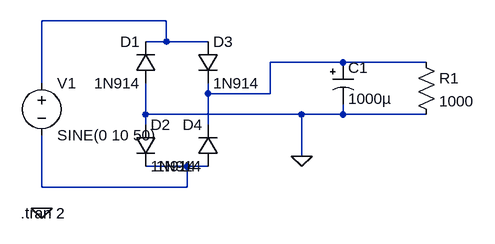
[diagram p0: schematic FullwaveBridgeRectifier.asc]
FullwaveBridgeRectifier.asc, the LTspice schematic file:
Version 4
SHEET 1 880 680
WIRE 176 32 -16 32
WIRE 176 64 176 32
WIRE 176 64 144 64
WIRE 240 64 176 64
WIRE 448 96 336 96
WIRE 576 96 448 96
WIRE -16 128 -16 32
WIRE 240 144 240 128
WIRE 336 144 336 96
WIRE 336 144 240 144
WIRE 144 176 144 128
WIRE 384 176 144 176
WIRE 448 176 448 160
WIRE 448 176 384 176
WIRE 576 176 448 176
WIRE 144 192 144 176
WIRE 240 192 240 144
WIRE 384 240 384 176
WIRE 208 256 144 256
WIRE 240 256 208 256
WIRE -16 288 -16 208
WIRE 208 288 208 256
WIRE 208 288 -16 288
FLAG -16 320 0
FLAG 384 240 0
SYMBOL diode 160 128 R180
WINDOW 0 24 64 Left 2
WINDOW 3 24 0 Left 2
SYMATTR InstName D1
SYMATTR Value 1N914
SYMBOL diode 128 192 R0
SYMATTR InstName D2
SYMATTR Value 1N914
SYMBOL diode 224 64 R0
SYMATTR InstName D3
SYMATTR Value 1N914
SYMBOL diode 256 256 R180
WINDOW 0 24 64 Left 2
WINDOW 3 24 0 Left 2
SYMATTR InstName D4
SYMATTR Value 1N914
SYMBOL voltage -16 112 R0
WINDOW 123 0 0 Left 0
WINDOW 39 0 0 Left 0
SYMATTR InstName V1
SYMATTR Value SINE(0 10 50)
SYMBOL res 560 80 R0
SYMATTR InstName R1
SYMATTR Value 1000
SYMBOL polcap 432 96 R0
WINDOW 3 24 56 Left 2
SYMATTR Value 1000µ
SYMATTR InstName C1
SYMATTR Description Capacitor
SYMATTR Type cap
SYMATTR SpiceLine V=10 Irms=1.06 Rser=0.06 Lser=0 mfg="Nichicon" pn="UPL1A102MPH" type="Al electrolytic"
TEXT -48 328 Left 2 !.tran 2

The netlist it stands for:
* FullwaveBridgeRectifier.asc
D1 0 N001 1N914
D2 0 N003 1N914
D3 N001 N002 1N914
D4 N003 N002 1N914
V1 N001 N003 SINE(0 10 50)
R1 N002 0 1000
C1 N002 0 1000µ V=10 Irms=1.06 Rser=0.06 Lser=0 mfg="Nichicon" pn="UPL1A102MPH" type="Al electrolytic"
.model D D
.lib standard.dio
.tran 2
.backanno
.end